# Altium schematic sheet 4_Comp.SCHDOC
size 297 x 209 mm; SheetNumber: 15; SheetTotal: 18; DocumentName: 4_Comp.SCHDOC
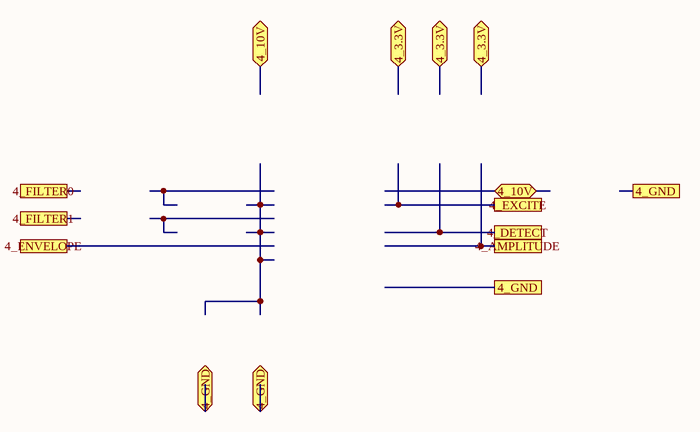
[diagram p0: 4_Comp.SCHDOC]

## Ports
4_3.3V, 4_10V, 4_10V (bidir), 4_AMPLITUDE, 4_DETECT, 4_ENVELOPE, 4_EXCITE, 4_FILTER0, 4_FILTER1, 4_GND

## Notes on the sheet
- A
- B
- C
- D
- 1
- 2
- 3
- Title
- 4
- Size
- A4
- Number
- Rev
- Date
- Filename
- Drawn by
- Sheet
- of